# EAGLE schematic driver_board (EAGLE 6.4)
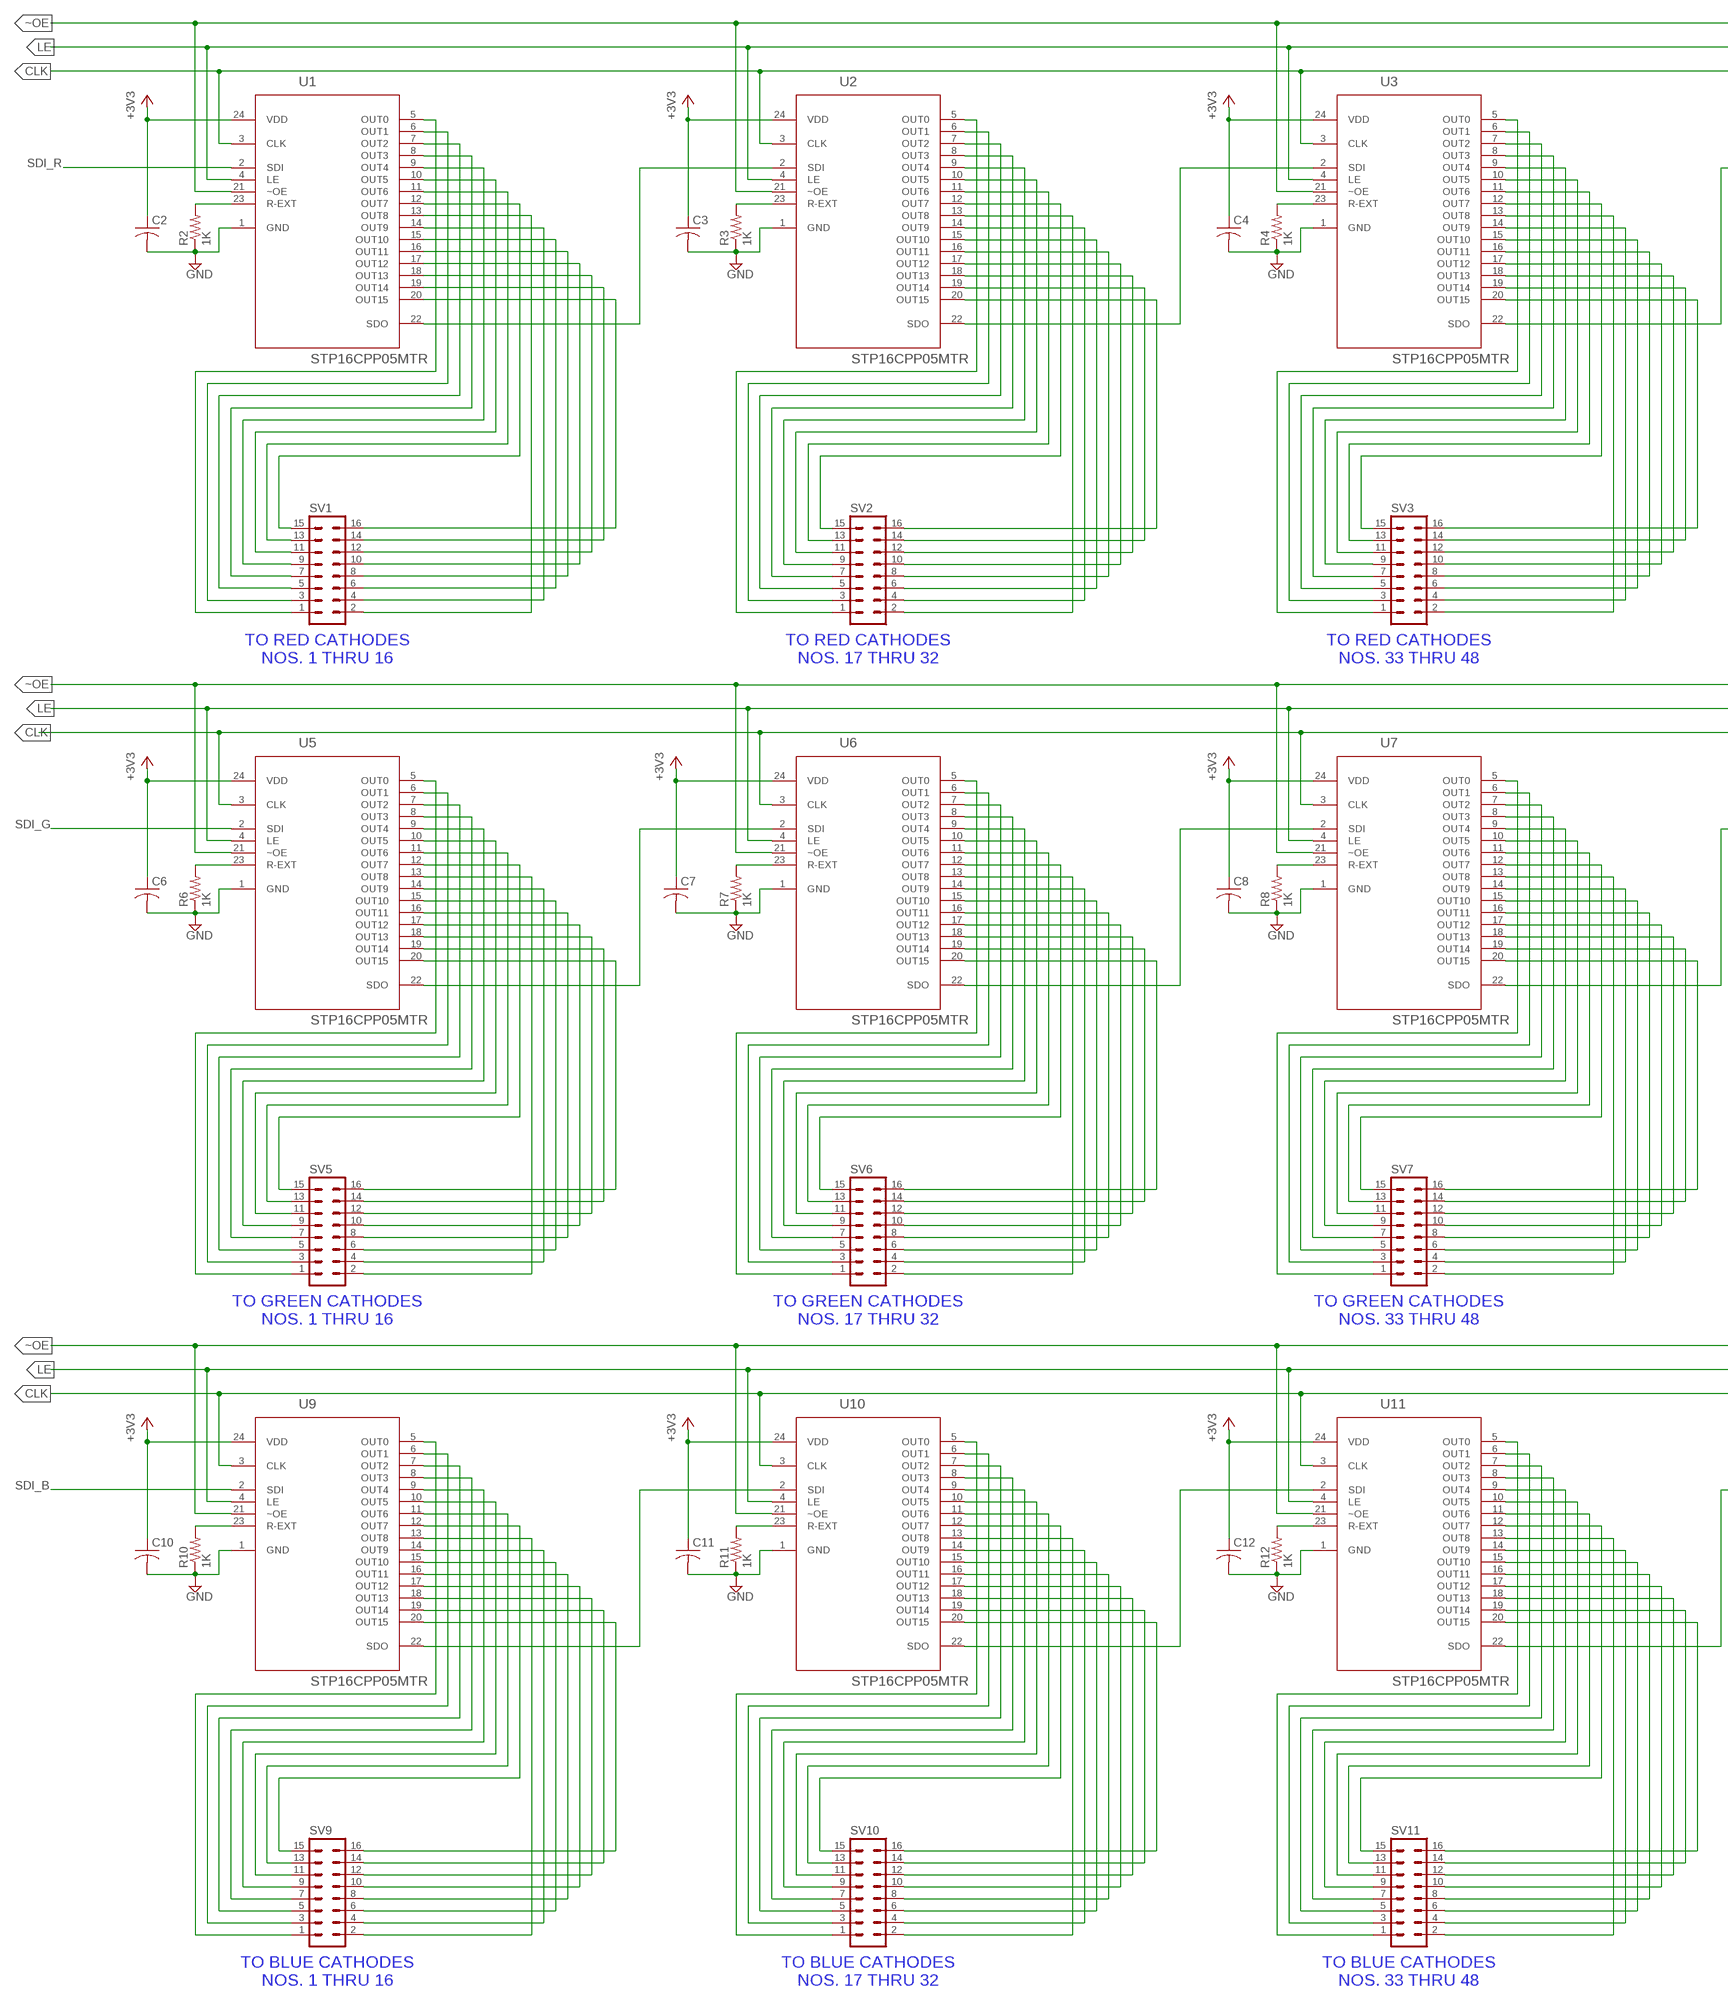
[diagram p0: schematic, sheet 1, part 1 of 2]
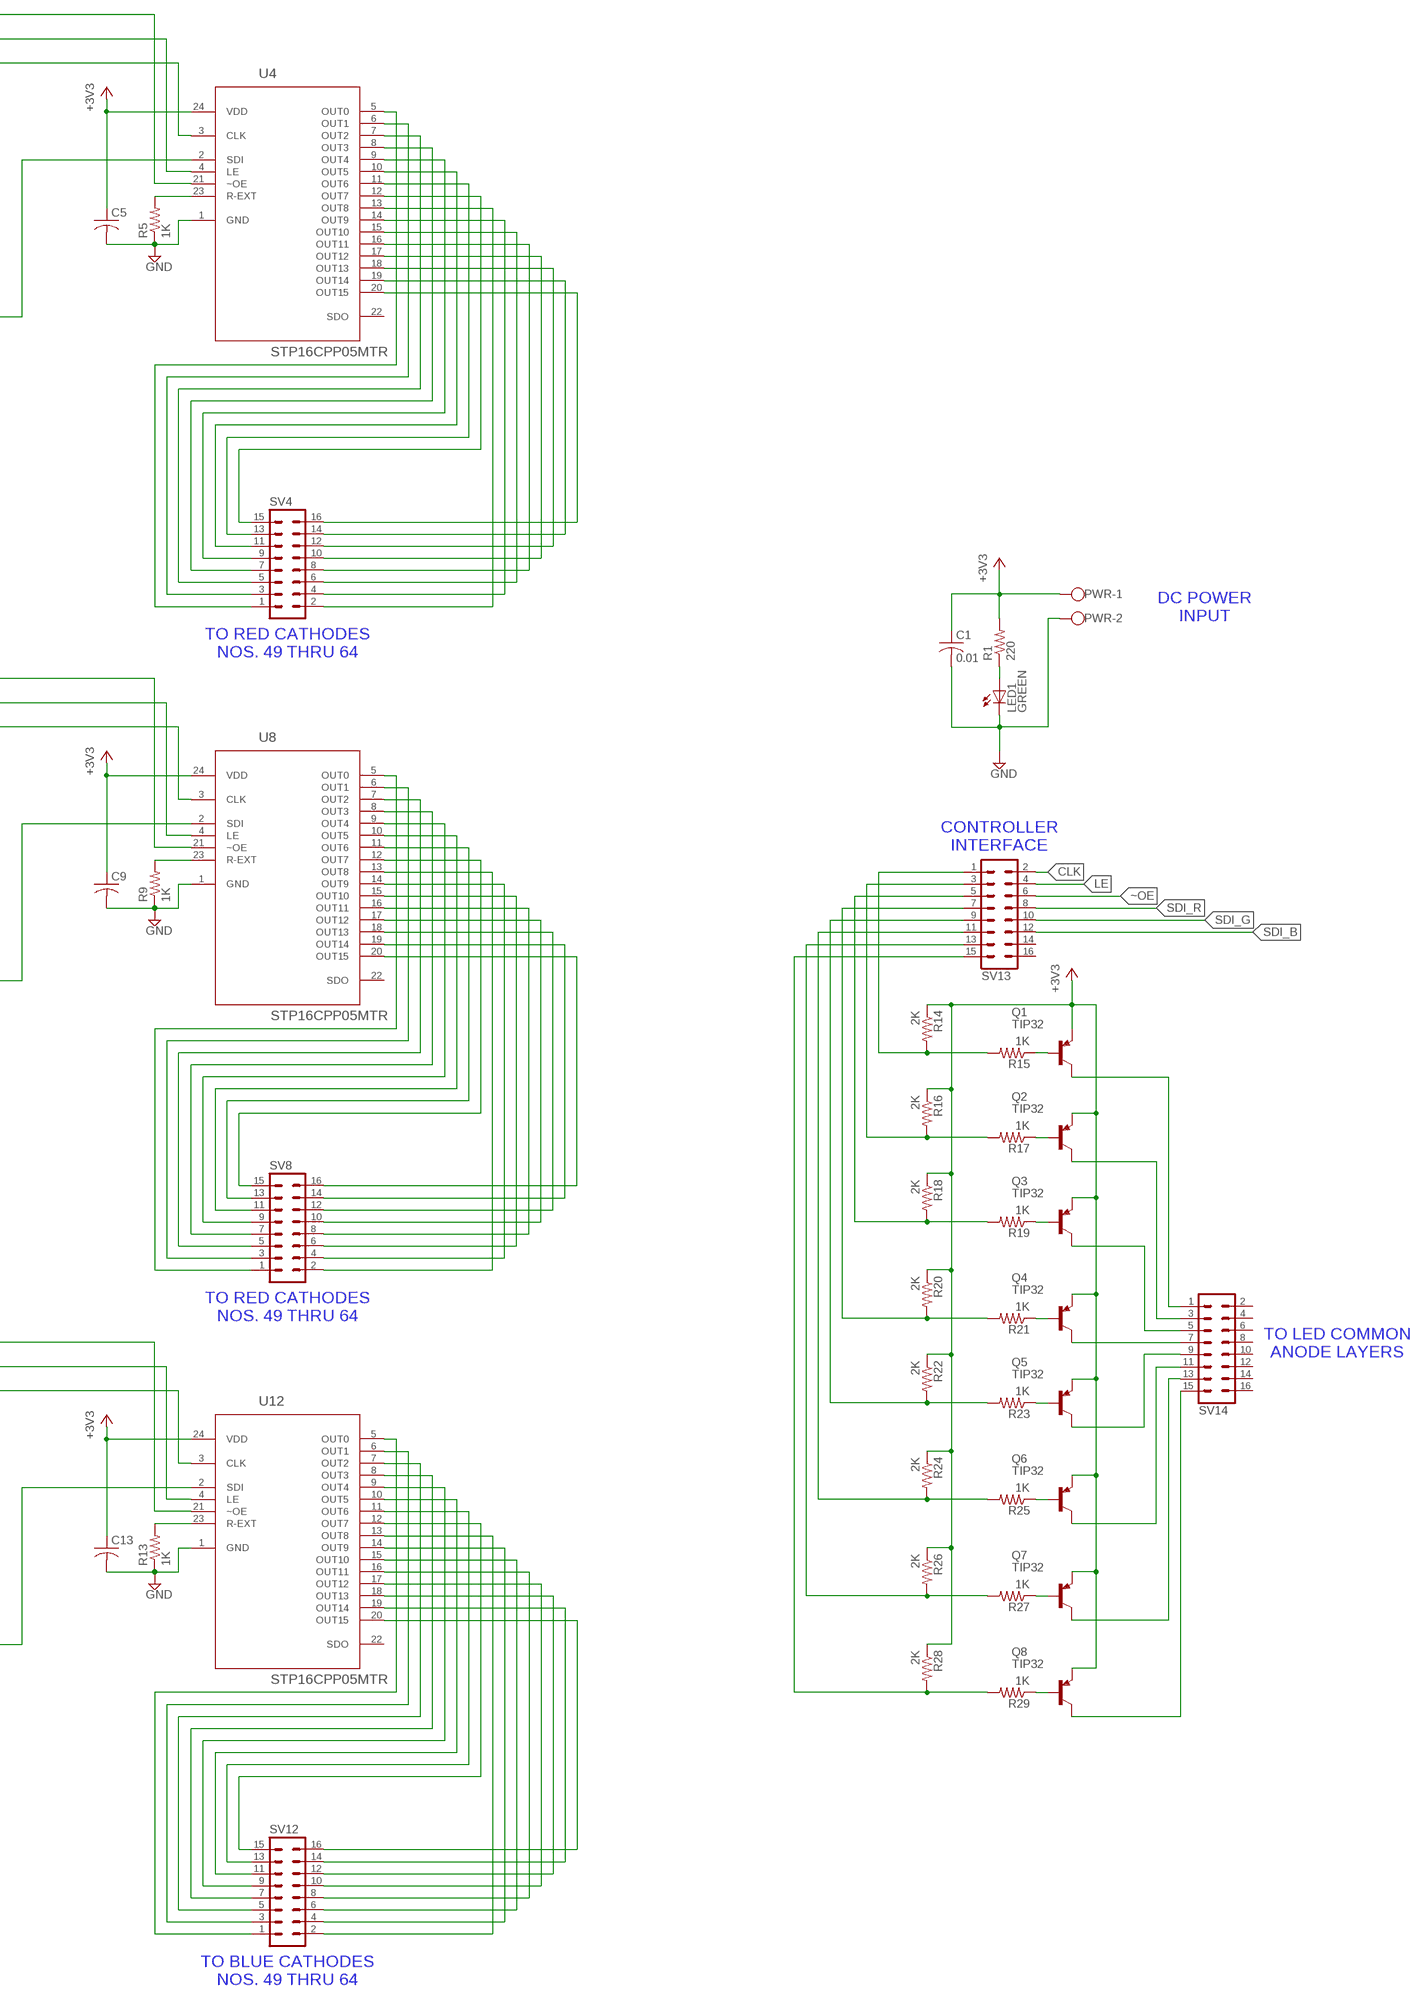
[diagram p1: schematic, sheet 1, part 2 of 2]

## Parts
C1  0.01  C-USC0805  [C0805]
C2  C-USC0805  [C0805]
C3  C-USC0805  [C0805]
C4  C-USC0805  [C0805]
C5  C-USC0805  [C0805]
C6  C-USC0805  [C0805]
C7  C-USC0805  [C0805]
C8  C-USC0805  [C0805]
C9  C-USC0805  [C0805]
C10  C-USC0805  [C0805]
C11  C-USC0805  [C0805]
C12  C-USC0805  [C0805]
C13  C-USC0805  [C0805]
LED1  GREEN  LED5MM  [LED5MM]
PWR  W237-102  [W237-102]
Q1  TIP32  [TO220AV]
Q2  TIP32  [TO220AV]
Q3  TIP32  [TO220AV]
Q4  TIP32  [TO220AV]
Q5  TIP32  [TO220AV]
Q6  TIP32  [TO220AV]
Q7  TIP32  [TO220AV]
Q8  TIP32  [TO220AV]
R1  220  R-US_R0805  [R0805]
R2  1K  R-US_R0805  [R0805]
R3  1K  R-US_R0805  [R0805]
R4  1K  R-US_R0805  [R0805]
R5  1K  R-US_R0805  [R0805]
R6  1K  R-US_R0805  [R0805]
R7  1K  R-US_R0805  [R0805]
R8  1K  R-US_R0805  [R0805]
R9  1K  R-US_R0805  [R0805]
R10  1K  R-US_R0805  [R0805]
R11  1K  R-US_R0805  [R0805]
R12  1K  R-US_R0805  [R0805]
R13  1K  R-US_R0805  [R0805]
R14  2K  R-US_R0805  [R0805]
R15  1K  R-US_R0805  [R0805]
R16  2K  R-US_R0805  [R0805]
R17  1K  R-US_R0805  [R0805]
R18  2K  R-US_R0805  [R0805]
R19  1K  R-US_R0805  [R0805]
R20  2K  R-US_R0805  [R0805]
R21  1K  R-US_R0805  [R0805]
R22  2K  R-US_R0805  [R0805]
R23  1K  R-US_R0805  [R0805]
R24  2K  R-US_R0805  [R0805]
R25  1K  R-US_R0805  [R0805]
R26  2K  R-US_R0805  [R0805]
R27  1K  R-US_R0805  [R0805]
R28  2K  R-US_R0805  [R0805]
R29  1K  R-US_R0805  [R0805]
SV1  16PL  [16PL]
SV2  16PL  [16PL]
SV3  16PL  [16PL]
SV4  16PL  [16PL]
SV5  16PL  [16PL]
SV6  16PL  [16PL]
SV7  16PL  [16PL]
SV8  16PL  [16PL]
SV9  16PL  [16PL]
SV10  16PL  [16PL]
SV11  16PL  [16PL]
SV12  16PL  [16PL]
SV13  16PL  [16PL]
SV14  16PL  [16PL]
U1  STP16CPP05MTR  [SOIC127P1032X265-24N]
U2  STP16CPP05MTR  [SOIC127P1032X265-24N]
U3  STP16CPP05MTR  [SOIC127P1032X265-24N]
U4  STP16CPP05MTR  [SOIC127P1032X265-24N]
U5  STP16CPP05MTR  [SOIC127P1032X265-24N]
U6  STP16CPP05MTR  [SOIC127P1032X265-24N]
U7  STP16CPP05MTR  [SOIC127P1032X265-24N]
U8  STP16CPP05MTR  [SOIC127P1032X265-24N]
U9  STP16CPP05MTR  [SOIC127P1032X265-24N]
U10  STP16CPP05MTR  [SOIC127P1032X265-24N]
U11  STP16CPP05MTR  [SOIC127P1032X265-24N]
U12  STP16CPP05MTR  [SOIC127P1032X265-24N]

## Nets
+3V3 [+3V3]: C1.1 C2.1 C3.1 C4.1 C5.1 C6.1 C7.1 C8.1 C9.1 C10.1 C11.1 C12.1 C13.1 PWR.1 Q1.E Q2.E Q3.E Q4.E Q5.E Q6.E Q7.E Q8.E R1.2 R14.1 R16.1 R18.1 R20.1 R22.1 R24.1 R26.1 R28.1 U1.24(VDD) U2.24(VDD) U3.24(VDD) U4.24(VDD) U5.24(VDD) U6.24(VDD) U7.24(VDD) U8.24(VDD) U9.24(VDD) U10.24(VDD) U11.24(VDD) U12.24(VDD)
CLK: SV13.2 U1.3(CLK) U2.3(CLK) U3.3(CLK) U4.3(CLK) U5.3(CLK) U6.3(CLK) U7.3(CLK) U8.3(CLK) U9.3(CLK) U10.3(CLK) U11.3(CLK) U12.3(CLK)
GND [GND]: C1.2 C2.2 C3.2 C4.2 C5.2 C6.2 C7.2 C8.2 C9.2 C10.2 C11.2 C12.2 C13.2 LED1.K(C) PWR.2 R2.1 R3.1 R4.1 R5.1 R6.1 R7.1 R8.1 R9.1 R10.1 R11.1 R12.1 R13.1 U1.1(GND) U2.1(GND) U3.1(GND) U4.1(GND) U5.1(GND) U6.1(GND) U7.1(GND) U8.1(GND) U9.1(GND) U10.1(GND) U11.1(GND) U12.1(GND)
LE: SV13.4 U1.4(LE) U2.4(LE) U3.4(LE) U4.4(LE) U5.4(LE) U6.4(LE) U7.4(LE) U8.4(LE) U9.4(LE) U10.4(LE) U11.4(LE) U12.4(LE)
N$1: SV1.1 U1.5(OUT0)
N$2: SV1.5 U1.7(OUT2)
N$3: SV1.3 U1.6(OUT1)
N$4: SV1.7 U1.8(OUT3)
N$5: SV1.11 U1.10(OUT5)
N$6: SV1.13 U1.11(OUT6)
N$7: SV1.9 U1.9(OUT4)
N$8: SV1.15 U1.12(OUT7)
N$9: SV1.2 U1.13(OUT8)
N$10: SV1.4 U1.14(OUT9)
N$11: SV1.6 U1.15(OUT10)
N$12: SV1.8 U1.16(OUT11)
N$13: SV1.10 U1.17(OUT12)
N$14: SV1.12 U1.18(OUT13)
N$15: SV1.14 U1.19(OUT14)
N$16: SV1.16 U1.20(OUT15)
N$18: SV8.2 U8.13(OUT8)
N$19: R2.2 U1.23(R-EXT)
N$20: SV8.4 U8.14(OUT9)
N$21: SV8.8 U8.16(OUT11)
N$22: SV8.6 U8.15(OUT10)
N$23: SV8.10 U8.17(OUT12)
N$24: SV8.12 U8.18(OUT13)
N$25: SV8.14 U8.19(OUT14)
N$26: SV8.16 U8.20(OUT15)
N$27: SV2.1 U2.5(OUT0)
N$28: SV2.3 U2.6(OUT1)
N$29: SV2.5 U2.7(OUT2)
N$30: SV2.7 U2.8(OUT3)
N$31: SV2.11 U2.10(OUT5)
N$32: SV2.9 U2.9(OUT4)
N$33: SV2.13 U2.11(OUT6)
N$34: SV2.15 U2.12(OUT7)
N$36: R3.2 U2.23(R-EXT)
N$37: SV5.1 U5.5(OUT0)
N$38: SV5.3 U5.6(OUT1)
N$39: SV5.5 U5.7(OUT2)
N$40: SV5.7 U5.8(OUT3)
N$41: SV5.11 U5.10(OUT5)
N$42: SV5.9 U5.9(OUT4)
N$43: SV5.13 U5.11(OUT6)
N$44: SV5.15 U5.12(OUT7)
N$45: SV5.2 U5.13(OUT8)
N$46: SV5.4 U5.14(OUT9)
N$47: SV5.6 U5.15(OUT10)
N$48: SV5.8 U5.16(OUT11)
N$49: SV5.10 U5.17(OUT12)
N$50: SV5.12 U5.18(OUT13)
N$51: SV5.14 U5.19(OUT14)
N$52: SV5.16 U5.20(OUT15)
N$54: R4.2 U3.23(R-EXT)
N$55: SV6.1 U6.5(OUT0)
N$56: SV6.3 U6.6(OUT1)
N$57: SV6.5 U6.7(OUT2)
N$58: SV6.7 U6.8(OUT3)
N$59: SV6.11 U6.10(OUT5)
N$60: SV6.9 U6.9(OUT4)
N$61: SV6.13 U6.11(OUT6)
N$62: SV6.15 U6.12(OUT7)
N$63: SV6.2 U6.13(OUT8)
N$64: SV6.4 U6.14(OUT9)
N$65: SV6.6 U6.15(OUT10)
N$66: SV6.8 U6.16(OUT11)
N$67: SV6.10 U6.17(OUT12)
N$68: SV6.12 U6.18(OUT13)
N$69: SV6.14 U6.19(OUT14)
N$70: SV6.16 U6.20(OUT15)
N$72: R5.2 U4.23(R-EXT)
N$73: SV7.1 U7.5(OUT0)
N$74: SV7.3 U7.6(OUT1)
N$75: SV7.5 U7.7(OUT2)
N$76: SV7.7 U7.8(OUT3)
N$77: SV7.11 U7.10(OUT5)
N$78: SV7.9 U7.9(OUT4)
N$79: SV7.13 U7.11(OUT6)
N$80: SV7.15 U7.12(OUT7)
N$81: SV7.2 U7.13(OUT8)
N$82: SV7.4 U7.14(OUT9)
N$83: SV7.6 U7.15(OUT10)
N$84: SV7.8 U7.16(OUT11)
N$85: SV7.10 U7.17(OUT12)
N$86: SV7.12 U7.18(OUT13)
N$87: SV7.14 U7.19(OUT14)
N$88: SV7.16 U7.20(OUT15)
N$90: R6.2 U5.23(R-EXT)
N$91: SV8.1 U8.5(OUT0)
N$92: SV8.3 U8.6(OUT1)
N$93: SV8.5 U8.7(OUT2)
N$94: SV8.7 U8.8(OUT3)
N$95: SV8.11 U8.10(OUT5)
N$96: SV8.9 U8.9(OUT4)
N$97: SV8.13 U8.11(OUT6)
N$98: SV8.15 U8.12(OUT7)
N$99: SV2.2 U2.13(OUT8)
N$100: SV2.4 U2.14(OUT9)
N$101: SV2.6 U2.15(OUT10)
N$102: SV2.8 U2.16(OUT11)
N$103: SV2.12 U2.18(OUT13)
N$104: SV2.14 U2.19(OUT14)
N$105: SV2.16 U2.20(OUT15)
N$106: SV2.10 U2.17(OUT12)
N$107: SV3.1 U3.5(OUT0)
N$108: R7.2 U6.23(R-EXT)
N$109: SV3.3 U3.6(OUT1)
N$110: SV3.5 U3.7(OUT2)
N$111: SV3.7 U3.8(OUT3)
N$112: SV3.9 U3.9(OUT4)
N$113: SV3.11 U3.10(OUT5)
N$114: SV3.13 U3.11(OUT6)
N$115: SV3.15 U3.12(OUT7)
N$116: SV3.2 U3.13(OUT8)
N$117: SV3.4 U3.14(OUT9)
N$118: SV3.6 U3.15(OUT10)
N$119: SV3.8 U3.16(OUT11)
N$120: SV3.10 U3.17(OUT12)
N$121: SV3.12 U3.18(OUT13)
N$122: SV3.14 U3.19(OUT14)
N$123: SV3.16 U3.20(OUT15)
N$126: R8.2 U7.23(R-EXT)
N$142: SV4.1 U4.5(OUT0)
N$143: SV4.3 U4.6(OUT1)
N$144: R9.2 U8.23(R-EXT)
N$145: SV4.5 U4.7(OUT2)
N$146: SV4.7 U4.8(OUT3)
N$147: SV4.11 U4.10(OUT5)
N$148: SV4.9 U4.9(OUT4)
N$149: SV4.13 U4.11(OUT6)
N$150: SV4.15 U4.12(OUT7)
N$151: SV4.2 U4.13(OUT8)
N$152: SV4.4 U4.14(OUT9)
N$153: SV4.6 U4.15(OUT10)
N$154: SV4.8 U4.16(OUT11)
N$155: SV4.10 U4.17(OUT12)
N$156: SV4.12 U4.18(OUT13)
N$157: SV4.14 U4.19(OUT14)
N$158: SV4.16 U4.20(OUT15)
N$159: SV9.1 U9.5(OUT0)
N$160: SV9.3 U9.6(OUT1)
N$161: SV9.5 U9.7(OUT2)
N$162: R10.2 U9.23(R-EXT)
N$163: SV9.7 U9.8(OUT3)
N$164: SV9.11 U9.10(OUT5)
N$165: SV9.9 U9.9(OUT4)
N$166: SV9.13 U9.11(OUT6)
N$167: SV9.15 U9.12(OUT7)
N$168: SV9.2 U9.13(OUT8)
N$169: SV9.4 U9.14(OUT9)
N$170: SV9.6 U9.15(OUT10)
N$171: SV9.8 U9.16(OUT11)
N$172: SV9.10 U9.17(OUT12)
N$173: SV9.12 U9.18(OUT13)
N$174: SV9.14 U9.19(OUT14)
N$175: SV9.16 U9.20(OUT15)
N$176: SV10.1 U10.5(OUT0)
N$177: SV10.3 U10.6(OUT1)
N$178: SV10.5 U10.7(OUT2)
N$180: R11.2 U10.23(R-EXT)
N$181: SV10.7 U10.8(OUT3)
N$182: SV10.11 U10.10(OUT5)
N$183: SV10.9 U10.9(OUT4)
N$184: SV10.13 U10.11(OUT6)
N$185: SV10.15 U10.12(OUT7)
N$186: SV10.2 U10.13(OUT8)
N$187: SV10.4 U10.14(OUT9)
N$188: SV10.6 U10.15(OUT10)
N$189: SV10.8 U10.16(OUT11)
N$190: SV10.10 U10.17(OUT12)
N$191: SV10.12 U10.18(OUT13)
N$192: SV10.14 U10.19(OUT14)
N$193: SV10.16 U10.20(OUT15)
N$194: SV11.1 U11.5(OUT0)
N$195: SV11.3 U11.6(OUT1)
N$196: SV11.5 U11.7(OUT2)
N$197: SV11.7 U11.8(OUT3)
N$198: R12.2 U11.23(R-EXT)
N$199: SV11.11 U11.10(OUT5)
N$200: SV11.9 U11.9(OUT4)
N$201: SV11.13 U11.11(OUT6)
N$202: SV11.15 U11.12(OUT7)
N$203: SV11.2 U11.13(OUT8)
N$204: SV11.4 U11.14(OUT9)
N$205: SV11.6 U11.15(OUT10)
N$206: SV11.8 U11.16(OUT11)
N$207: SV11.10 U11.17(OUT12)
N$208: SV11.12 U11.18(OUT13)
N$209: SV11.14 U11.19(OUT14)
N$210: SV11.16 U11.20(OUT15)
N$211: SV12.1 U12.5(OUT0)
N$212: SV12.3 U12.6(OUT1)
N$213: SV12.5 U12.7(OUT2)
N$214: SV12.7 U12.8(OUT3)
N$215: SV12.11 U12.10(OUT5)
N$216: R13.2 U12.23(R-EXT)
N$217: U1.22(SDO) U2.2(SDI)
N$218: U2.22(SDO) U3.2(SDI)
N$219: U3.22(SDO) U4.2(SDI)
N$220: U5.22(SDO) U6.2(SDI)
N$221: U6.22(SDO) U7.2(SDI)
N$222: U7.22(SDO) U8.2(SDI)
N$223: U9.22(SDO) U10.2(SDI)
N$224: U10.22(SDO) U11.2(SDI)
N$225: U11.22(SDO) U12.2(SDI)
N$226: Q1.C SV14.1
N$227: Q2.C SV14.3
N$228: Q3.C SV14.5
N$229: Q4.C SV14.7
N$230: Q5.C SV14.9
N$231: Q6.C SV14.11
N$232: Q1.B R15.1
N$233: Q7.C SV14.13
N$234: Q8.C SV14.15
N$235: Q8.B R29.1
N$236: Q7.B R27.1
N$237: Q6.B R25.1
N$238: Q5.B R23.1
N$239: Q4.B R21.1
N$240: Q3.B R19.1
N$241: Q2.B R17.1
N$242: SV12.9 U12.9(OUT4)
N$243: R28.2 R29.2 SV13.15
N$244: LED1.A R1.1
N$245: R26.2 R27.2 SV13.13
N$246: R24.2 R25.2 SV13.11
N$247: R22.2 R23.2 SV13.9
N$248: R20.2 R21.2 SV13.7
N$249: R18.2 R19.2 SV13.5
N$250: R16.2 R17.2 SV13.3
N$251: R14.2 R15.2 SV13.1
N$252: SV12.13 U12.11(OUT6)
N$253: SV12.15 U12.12(OUT7)
N$254: SV12.2 U12.13(OUT8)
N$255: SV12.4 U12.14(OUT9)
N$256: SV12.6 U12.15(OUT10)
N$257: SV12.8 U12.16(OUT11)
N$258: SV12.10 U12.17(OUT12)
N$259: SV12.12 U12.18(OUT13)
N$260: SV12.14 U12.19(OUT14)
N$261: SV12.16 U12.20(OUT15)
SDI_B: SV13.12 U9.2(SDI)
SDI_G: SV13.10 U5.2(SDI)
SDI_R: SV13.8 U1.2(SDI)
~OE: SV13.6 U1.21(~OE) U2.21(~OE) U3.21(~OE) U4.21(~OE) U5.21(~OE) U6.21(~OE) U7.21(~OE) U8.21(~OE) U9.21(~OE) U10.21(~OE) U11.21(~OE) U12.21(~OE)
Unconnected: SV13.14 SV13.16 SV14.2 SV14.4 SV14.6 SV14.8 SV14.10 SV14.12 SV14.14 SV14.16 U4.22(SDO) U8.22(SDO) U12.22(SDO)

## Notes on the sheet
- DC POWER
  INPUT
- TO RED CATHODES
  NOS. 1 THRU 16
- TO RED CATHODES
  NOS. 17 THRU 32
- TO RED CATHODES
  NOS. 33 THRU 48
- TO RED CATHODES
  NOS. 49 THRU 64
- CONTROLLER
  INTERFACE
- TO GREEN CATHODES
  NOS. 1 THRU 16
- TO GREEN CATHODES
  NOS. 17 THRU 32
- TO GREEN CATHODES
  NOS. 33 THRU 48
- TO RED CATHODES
  NOS. 49 THRU 64
- TO LED COMMON
  ANODE LAYERS
- TO BLUE CATHODES
  NOS. 1 THRU 16
- TO BLUE CATHODES
  NOS. 17 THRU 32
- TO BLUE CATHODES
  NOS. 33 THRU 48
- TO BLUE CATHODES
  NOS. 49 THRU 64

## Library data of the parts
C1-C13 = adafruit:C-US: CAPACITOR, American symbol; MPN: MCCA001261; OC_NEWARK: 23T7439
LED1 = adafruit:LED: LED OSRAM: - CHIPLED LG R971, LG N971, LY N971, LG Q971, LY Q971, LO R971, LY R971 LH N974, LH R974 LS Q976, LO Q976, LY Q976 LO Q996 - Hyper CHIPLED LW Q18S LB Q993, LB Q99A, LB R99A - SideLED LS A670, LO A670, LY A670, LG A670, LP A670 LB A673, LV A673, LT A673, LW A673 LH A674 LY A675 LS A676, LA A676, LO A676, LY A676, LW A676 LS A679, LY A679, LG A679 - Hyper Micro SIDELED® LS Y876, LA Y876, LO Y876, LY Y876 LT Y87S - SmartLED LW L88C, LW L88S LB L89C, LB L89S, LG L890 LS L89K, LO L89K, LY L89K LS L896, LA L896, LO L896, LY L896 - TOPLED LS T670, LO T670, LY T670, LG T670, LP T670 LSG T670, LSP T670, LSY T670, LOP T670, LYG T670 LG T671, LOG T671, LSG T671 LB T673, LV T673, LT T673, LW T673 LH T674 LS T676, LA T676, LO T676, LY T676, LB T676, LH T676, LSB T676, LW T676 LB T67C, LV T67C, LT T67C, LS T67K, LO T67K, LY T67K, LW E67C LS E67B, LA E67B, LO E67B, LY E67B, LB E67C, LV E67C, LT E67C LW T67C LS T679, LY T679, LG T679 LS T770, LO T770, LY T770, LG T770, LP T770 LB T773, LV T773, LT T773, LW T773 LH T774 LS E675, LA E675, LY E675, LS T675 LS T776, LA T776, LO T776, LY T776, LB T776 LHGB T686 LT T68C, LB T68C - Hyper Mini TOPLED® LB M676 - Mini TOPLED Santana® LG M470 LS M47K, LO M47K, LY M47K Source: http://www.osram.convergy.de/; MF: SLI (CML/IDI); MPN: CMD17-21VGD/TR8; OC_NEWARK: 34C8662
PWR = con-wago-500:W237-102: WAGO SCREW CLAMP; OC_FARNELL: unknown; OC_NEWARK: unknown
Q1-Q8 = transistor-pnp:TIP32; MF: ON SEMICONDUCTOR; MPN: TIP32BG; OC_NEWARK: 26K5215
R1 = adafruit:R-US_: RESISTOR, American symbol; MPN: MCHP05W4F2200T5E; OC_NEWARK: 01N7012
R2-R13 = adafruit:R-US_: RESISTOR, American symbol; MPN: MC01W080511K; OC_NEWARK: 07W5249
R14-R29 = adafruit:R-US_: RESISTOR, American symbol; OC_NEWARK: unknown
SV1-SV14 = con-dil:16PL: DIL CABLE CONNECTOR; MF: FARNELL; MPN: 008380016000010; OC_NEWARK: 15J1676
U1-U12 = ST Microelctronics_By_element14_Batch_1:STP16CPP05MTR: LED sink driver; MPN: STP16CPP05MTR; OC_FARNELL: -; OC_NEWARK: 09R6077; PACKAGE: SOIC-24; SUPPLIER: STMICROELECTRONICS

## Net classes
0 default: width 0.305 mm, drill 0.508 mm, clearance 0.355 mm
1 GND: width 0.61 mm, clearance 0.355 mm to class 0, clearance 0.355 mm
2 +3V3: width 0.965 mm, clearance 0.355 mm to class 0, clearance 0.355 mm to class 1, clearance 0.355 mm